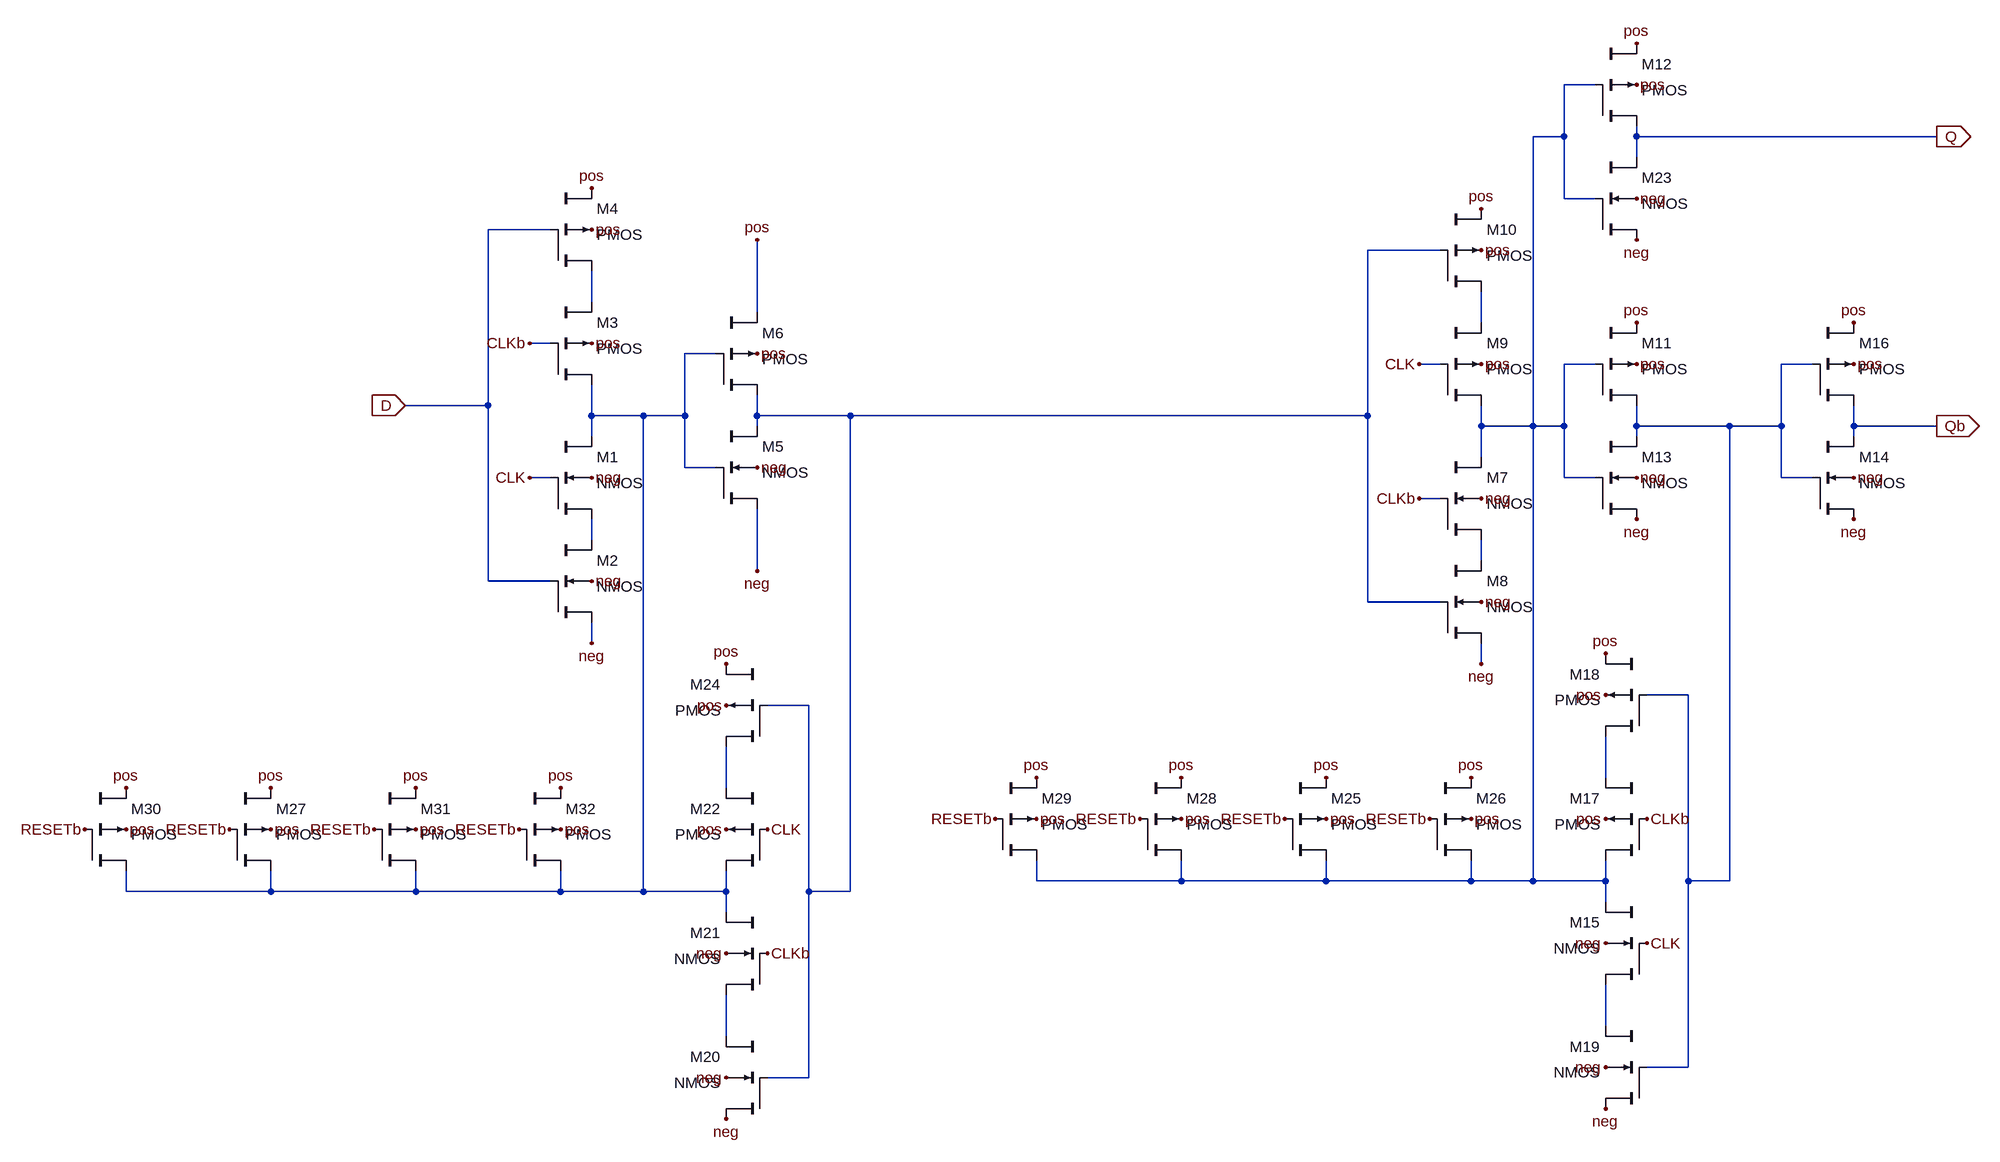
[diagram p0: schematic ResetFlipFlop_Low_LDS.asc]
ResetFlipFlop_Low_LDS.asc, the LTspice schematic file:
Version 4
SHEET 1 3724 680
WIRE -128 -1424 -176 -1424
WIRE -176 -1344 -176 -1424
WIRE -176 -1344 -224 -1344
WIRE -64 -1344 -64 -1360
WIRE 400 -1344 -64 -1344
WIRE -64 -1312 -64 -1344
WIRE -176 -1248 -176 -1344
WIRE -128 -1248 -176 -1248
WIRE -1744 -1200 -1840 -1200
WIRE -368 -1168 -480 -1168
WIRE -1680 -1088 -1680 -1136
WIRE -1424 -1072 -1424 -1184
WIRE -304 -1056 -304 -1104
WIRE -1744 -1024 -1776 -1024
WIRE -1488 -1008 -1536 -1008
WIRE -368 -992 -400 -992
WIRE -128 -992 -176 -992
WIRE 208 -992 160 -992
WIRE -1840 -928 -1840 -1200
WIRE -1840 -928 -1968 -928
WIRE -1680 -912 -1680 -960
WIRE -1600 -912 -1680 -912
WIRE -1536 -912 -1536 -1008
WIRE -1536 -912 -1600 -912
WIRE -1424 -912 -1424 -944
WIRE -1280 -912 -1424 -912
WIRE -480 -912 -480 -1168
WIRE -480 -912 -1280 -912
WIRE -1424 -896 -1424 -912
WIRE -304 -896 -304 -928
WIRE -224 -896 -224 -1344
WIRE -224 -896 -304 -896
WIRE -176 -896 -176 -992
WIRE -176 -896 -224 -896
WIRE -64 -896 -64 -928
WIRE 80 -896 -64 -896
WIRE 160 -896 160 -992
WIRE 160 -896 80 -896
WIRE 272 -896 272 -928
WIRE 400 -896 272 -896
WIRE -1680 -880 -1680 -912
WIRE -64 -880 -64 -896
WIRE 272 -880 272 -896
WIRE -304 -848 -304 -896
WIRE -1536 -832 -1536 -912
WIRE -1488 -832 -1536 -832
WIRE -1744 -816 -1776 -816
WIRE -176 -816 -176 -896
WIRE -128 -816 -176 -816
WIRE 160 -816 160 -896
WIRE 208 -816 160 -816
WIRE -368 -784 -400 -784
WIRE -1680 -720 -1680 -752
WIRE -304 -688 -304 -720
WIRE -1424 -672 -1424 -768
WIRE -1840 -656 -1840 -928
WIRE -1744 -656 -1840 -656
WIRE -480 -624 -480 -912
WIRE -368 -624 -480 -624
WIRE -1680 -560 -1680 -592
WIRE -304 -528 -304 -560
WIRE 16 -480 -48 -480
WIRE -1344 -464 -1408 -464
WIRE -112 -352 -112 -416
WIRE -1472 -336 -1472 -400
WIRE -992 -192 -992 -224
WIRE -768 -192 -768 -224
WIRE -768 -192 -992 -192
WIRE -544 -192 -544 -224
WIRE -544 -192 -768 -192
WIRE -320 -192 -320 -224
WIRE -320 -192 -544 -192
WIRE -224 -192 -224 -896
WIRE -224 -192 -320 -192
WIRE -112 -192 -112 -224
WIRE -112 -192 -224 -192
WIRE 16 -192 16 -480
WIRE 80 -192 80 -896
WIRE 80 -192 16 -192
WIRE -2400 -176 -2400 -208
WIRE -2176 -176 -2176 -208
WIRE -2176 -176 -2400 -176
WIRE -1952 -176 -1952 -208
WIRE -1952 -176 -2176 -176
WIRE -1728 -176 -1728 -208
WIRE -1728 -176 -1952 -176
WIRE -1600 -176 -1600 -912
WIRE -1600 -176 -1728 -176
WIRE -1472 -176 -1472 -208
WIRE -1472 -176 -1600 -176
WIRE -1344 -176 -1344 -464
WIRE -1280 -176 -1280 -912
WIRE -1280 -176 -1344 -176
WIRE -112 -160 -112 -192
WIRE -1472 -144 -1472 -176
WIRE -112 32 -112 -32
WIRE -1472 48 -1472 -16
WIRE 16 96 16 -192
WIRE 16 96 -48 96
WIRE -1344 112 -1344 -176
WIRE -1344 112 -1408 112
FLAG -1680 -1264 pos
FLAG -1968 -928 D
IOPIN -1968 -928 In
FLAG -1776 -1024 CLKb
FLAG -1776 -816 CLK
FLAG -1680 -1024 pos
FLAG -1680 -1200 pos
FLAG -1680 -816 neg
FLAG -1680 -656 neg
FLAG -1680 -560 neg
FLAG -1424 -1184 pos
FLAG -1424 -1008 pos
FLAG -1424 -832 neg
FLAG -1424 -672 neg
FLAG -304 -1232 pos
FLAG -304 -992 pos
FLAG -304 -1168 pos
FLAG -304 -784 neg
FLAG -304 -624 neg
FLAG -304 -528 neg
FLAG -1472 -528 pos
FLAG -1472 -464 pos
FLAG -1472 -272 pos
FLAG -1472 176 neg
FLAG -1472 112 neg
FLAG -1472 -80 neg
FLAG -64 -992 pos
FLAG -64 -816 neg
FLAG -112 -544 pos
FLAG -112 -480 pos
FLAG -112 -288 pos
FLAG -112 160 neg
FLAG -112 96 neg
FLAG -112 -96 neg
FLAG -64 -752 neg
FLAG -64 -1056 pos
FLAG 272 -992 pos
FLAG 272 -816 neg
FLAG 272 -752 neg
FLAG 272 -1056 pos
FLAG 400 -896 Qb
IOPIN 400 -896 Out
FLAG 400 -1344 Q
IOPIN 400 -1344 Out
FLAG -400 -992 CLK
FLAG -400 -784 CLKb
FLAG -1408 -272 CLK
FLAG -1408 -80 CLKb
FLAG -48 -288 CLKb
FLAG -48 -96 CLK
FLAG -64 -1424 pos
FLAG -64 -1248 neg
FLAG -64 -1184 neg
FLAG -64 -1488 pos
FLAG -384 -288 RESETb
FLAG -320 -352 pos
FLAG -320 -288 pos
FLAG -608 -288 RESETb
FLAG -544 -352 pos
FLAG -544 -288 pos
FLAG -832 -288 RESETb
FLAG -768 -352 pos
FLAG -768 -288 pos
FLAG -1056 -288 RESETb
FLAG -992 -352 pos
FLAG -992 -288 pos
FLAG -1792 -272 RESETb
FLAG -1728 -336 pos
FLAG -1728 -272 pos
FLAG -2016 -272 RESETb
FLAG -1952 -336 pos
FLAG -1952 -272 pos
FLAG -2240 -272 RESETb
FLAG -2176 -336 pos
FLAG -2176 -272 pos
FLAG -2464 -272 RESETb
FLAG -2400 -336 pos
FLAG -2400 -272 pos
SYMBOL cktsym\\nmos4 -1680 -816 R0
SYMATTR InstName M1
SYMATTR Value2 l=0.9u w=3u
SYMBOL cktsym\\pmos4 -1680 -1200 R0
SYMATTR InstName M4
SYMATTR Value2 l=0.9u w=6u
SYMBOL cktsym\\pmos4 -768 -288 R0
SYMATTR InstName M28
SYMATTR Value2 l=0.9u w=7.8u
SYMBOL cktsym\\pmos4 -992 -288 R0
SYMATTR InstName M29
SYMATTR Value2 l=0.9u w=12.6u
SYMBOL cktsym\\pmos4 -1680 -1024 R0
SYMATTR InstName M3
SYMATTR Value2 l=0.9u w=6u
SYMBOL cktsym\\pmos4 -1424 -1008 R0
SYMATTR InstName M6
SYMATTR Value2 l=0.9u w=6u
SYMBOL cktsym\\pmos4 -304 -992 R0
SYMATTR InstName M9
SYMATTR Value2 l=0.9u w=6u
SYMBOL cktsym\\pmos4 -304 -1168 R0
SYMATTR InstName M10
SYMATTR Value2 l=0.9u w=6u
SYMBOL cktsym\\pmos4 -64 -992 R0
SYMATTR InstName M11
SYMATTR Value2 l=0.9u w=6u
SYMBOL cktsym\\pmos4 -64 -1424 R0
SYMATTR InstName M12
SYMATTR Value2 l=0.9u w=6u
SYMBOL cktsym\\pmos4 272 -992 R0
SYMATTR InstName M16
SYMATTR Value2 l=0.9u w=6u
SYMBOL cktsym\\pmos4 -112 -288 M0
SYMATTR InstName M17
SYMATTR Value2 l=0.9u w=6u
SYMBOL cktsym\\pmos4 -112 -480 M0
SYMATTR InstName M18
SYMATTR Value2 l=0.9u w=6u
SYMBOL cktsym\\pmos4 -1472 -272 M0
SYMATTR InstName M22
SYMATTR Value2 l=0.9u w=6u
SYMBOL cktsym\\pmos4 -1472 -464 M0
SYMATTR InstName M24
SYMATTR Value2 l=0.9u w=6u
SYMBOL cktsym\\nmos4 -1680 -656 R0
SYMATTR InstName M2
SYMATTR Value2 l=0.9u w=3u
SYMBOL cktsym\\nmos4 -1424 -832 R0
SYMATTR InstName M5
SYMATTR Value2 l=0.9u w=3u
SYMBOL cktsym\\nmos4 -304 -784 R0
SYMATTR InstName M7
SYMATTR Value2 l=0.9u w=3u
SYMBOL cktsym\\nmos4 -304 -624 R0
SYMATTR InstName M8
SYMATTR Value2 l=0.9u w=3u
SYMBOL cktsym\\nmos4 -64 -816 R0
SYMATTR InstName M13
SYMATTR Value2 l=0.9u w=3u
SYMBOL cktsym\\nmos4 272 -816 R0
SYMATTR InstName M14
SYMATTR Value2 l=0.9u w=3u
SYMBOL cktsym\\nmos4 -112 -96 M0
SYMATTR InstName M15
SYMATTR Value2 l=0.9u w=3u
SYMBOL cktsym\\nmos4 -112 96 M0
SYMATTR InstName M19
SYMATTR Value2 l=0.9u w=3u
SYMBOL cktsym\\nmos4 -1472 112 M0
SYMATTR InstName M20
SYMATTR Value2 l=0.9u w=3u
SYMBOL cktsym\\nmos4 -1472 -80 M0
SYMATTR InstName M21
SYMATTR Value2 l=0.9u w=3u
SYMBOL cktsym\\pmos4 -544 -288 R0
SYMATTR InstName M25
SYMATTR Value2 l=0.9u w=7.8u
SYMBOL cktsym\\pmos4 -320 -288 R0
SYMATTR InstName M26
SYMATTR Value2 l=0.9u w=7.8u
SYMBOL cktsym\\pmos4 -2176 -272 R0
SYMATTR InstName M27
SYMATTR Value2 l=0.9u w=7.8u
SYMBOL cktsym\\pmos4 -2400 -272 R0
SYMATTR InstName M30
SYMATTR Value2 l=0.9u w=12.6u
SYMBOL cktsym\\pmos4 -1952 -272 R0
SYMATTR InstName M31
SYMATTR Value2 l=0.9u w=7.8u
SYMBOL cktsym\\pmos4 -1728 -272 R0
SYMATTR InstName M32
SYMATTR Value2 l=0.9u w=7.8u
SYMBOL cktsym\\nmos4 -64 -1248 R0
SYMATTR InstName M23
SYMATTR Value2 l=0.9u w=3u

The netlist it stands for:
* ResetFlipFlop_Low_LDS.asc
M1 N005 CLK N007 neg NMOS l=0.9u w=3u
M4 N003 D pos pos PMOS l=0.9u w=6u
M28 N001 RESETb pos pos PMOS l=0.9u w=7.8u
M29 N001 RESETb pos pos PMOS l=0.9u w=12.6u
M3 N005 CLKb N003 pos PMOS l=0.9u w=6u
M6 N002 N005 pos pos PMOS l=0.9u w=6u
M9 N001 CLK N004 pos PMOS l=0.9u w=6u
M10 N004 N002 pos pos PMOS l=0.9u w=6u
M11 N006 N001 pos pos PMOS l=0.9u w=6u
M12 Q N001 pos pos PMOS l=0.9u w=6u
M16 Qb N006 pos pos PMOS l=0.9u w=6u
M17 N001 CLKb N009 pos PMOS l=0.9u w=6u
M18 N009 N006 pos pos PMOS l=0.9u w=6u
M22 N005 CLK N010 pos PMOS l=0.9u w=6u
M24 N010 N002 pos pos PMOS l=0.9u w=6u
M2 N007 D neg neg NMOS l=0.9u w=3u
M5 N002 N005 neg neg NMOS l=0.9u w=3u
M7 N001 CLKb N008 neg NMOS l=0.9u w=3u
M8 N008 N002 neg neg NMOS l=0.9u w=3u
M13 N006 N001 neg neg NMOS l=0.9u w=3u
M14 Qb N006 neg neg NMOS l=0.9u w=3u
M15 N001 CLK N011 neg NMOS l=0.9u w=3u
M19 N011 N006 neg neg NMOS l=0.9u w=3u
M20 N012 N002 neg neg NMOS l=0.9u w=3u
M21 N005 CLKb N012 neg NMOS l=0.9u w=3u
M25 N001 RESETb pos pos PMOS l=0.9u w=7.8u
M26 N001 RESETb pos pos PMOS l=0.9u w=7.8u
M27 N005 RESETb pos pos PMOS l=0.9u w=7.8u
M30 N005 RESETb pos pos PMOS l=0.9u w=12.6u
M31 N005 RESETb pos pos PMOS l=0.9u w=7.8u
M32 N005 RESETb pos pos PMOS l=0.9u w=7.8u
M23 Q N001 neg neg NMOS l=0.9u w=3u
.model NMOS NMOS
.model PMOS PMOS
.lib standard.mos
.backanno
.end